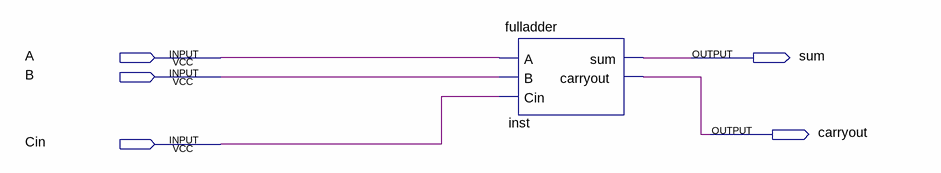
[diagram p0: schematic sheet]
// Quartus schematic lab1.bdf as structural Verilog: 1 symbols, 5 pins
module lab1 (
  input  A,
  input  B,
  input  Cin,
  output sum,
  output carryout
);

  fulladder inst (.A(A), .B(B), .Cin(Cin), .sum(sum), .carryout(carryout));
endmodule
